# EAGLE design edisonLight (EAGLE 7.0.0)
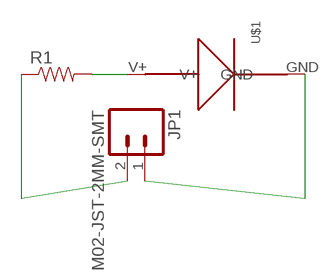
[diagram p0: schematic, sheet 1]

## Parts
JP1  M02-JST-2MM-SMT  [JST-2-SMD]
R1  RESISTOR2010  [R2010]
U$1  MYLEDDEV  [LTW-Z5630LED]

## Nets
N$1: R1.2 U$1.V+
N$2: JP1.1 U$1.GND
N$3: JP1.2 R1.1

## Library data of the parts
JP1 = SparkFun-Connectors:M02: Standard 2-pin 0.1" header. Use with - straight break away headers ( PRT-00116) - right angle break away headers (PRT-00553) - swiss pins (PRT-00743) - machine pins (PRT-00117) - female headers (PRT-00115) Molex polarized connector foot print use with: PRT-08233 with associated crimp pins and housings. 2.54_SCREWTERM for use with PRT-10571. 3.5mm Screw Terminal footprints for PRT-08084 5mm Screw Terminal footprints for use with PRT-08432; PROD_ID: CONN-08352
R1 = SparkFun-Resistors:RESISTOR: Resistor Basic schematic elements and footprints for 0603, 1206, and PTH resistors.
U$1 = Jakelbr:MYLEDDEV

## Board
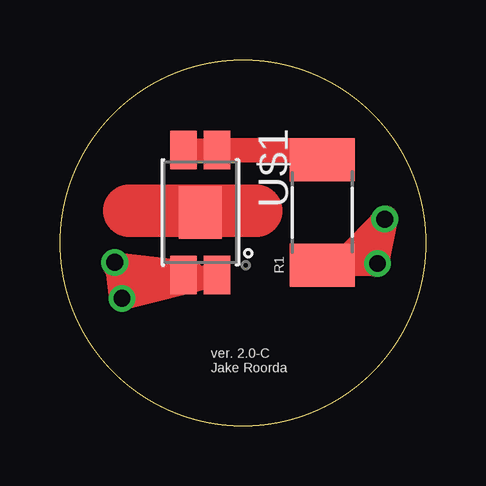
[diagram p1: board, top side]
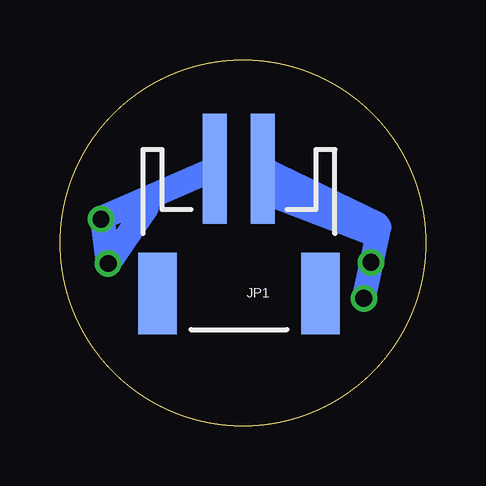
[diagram p2: board, bottom side, seen from below]

Size 15.24 x 15.24 mm. Coordinates in mm from the lower left corner, seen from the top.
Outline: circle at 7.62,7.62 radius 7.62
Copper layers (1*16): Top 0.035mm / dielectric 1.5mm / Bottom 0.035mm
Design rules "default": minimum track width 10mil, minimum drill 24mil, track to track 8mil, track to pad 8mil, pad to pad 8mil, via to via 8mil, smd to smd 8mil, copper to edge 40mil, drill to drill 8mil, minimum pad ring 10mil, minimum via ring 8mil, stop-mask expansion 4mil, vias tented up to drill 0mil, thermal gap 10mil

### Footprints (pad centres in the part's own frame; a part is rotated, then mirrored left to right if it is on the bottom)
JST-2-SMD = smd 1 x 4.6: 1 -1,-3.7; 2 1,-3.7 | smd 1.6 x 3.4: NC1 -3.4,1.5; NC2 3.4,1.5
R2010 = smd 1.8 x 2.7: 1 -2.2,0; 2 2.2,0
LTW-Z5630LED = smd 1.6 x 1.1: GND 2.6,0.7; P$1 -2.6,-0.7; P$3 2.6,-0.7; V+ -2.6,0.7 | smd 2.2 x 1.8: P$6 0,0

### Placement (x,y rotation side)
JP1  7.78,7.01 180 bottom
R1  10.92,8.89 90 top
U$1  5.84,8.89 270 top

### Tracks (layer width: path | path; a pad name or v marks a point on that pad's centre or on a via)
N$1
  Top 1.016: U$1.V+ 10.92,11.49 R1.2
N$2  (via drill 0.7)
  Top 1.016: v2.58,5.31 6.54,6.31 U$1.GND
  Bottom 1.016: v2.58,5.31 1.93,8.27 2.03,8.42 JP1.1
N$3  (via drill 0.7)
  Top 1.016: v13.23,6.76 10.92,6.76 R1.1
  Bottom 1.016: 13.57,8.63 13.48,8.68 | 13.48,8.68 v13.23,6.76 11.63,9.11 | 13.48,8.68 JP1.2
N$5
  Top 1.016: 6.48,11.46 5.18,11.46
N$6
  Top 2.184: 8.18,8.96 2.88,8.96
N$7  (via drill 0.7)
  other vias: 13.53,8.61
N$8
  Top 1.016: 13.18,6.71 13.58,8.66 11.88,6.91
N$9
  Bottom 1.016: 6.58,9.66 2.13,7.96
N$10  (via drill 0.7)
  other vias: 2.28,6.81
N$11
  Top 1.016: 5.23,6.31 2.53,5.51 2.38,6.71 5.48,6.36 2.33,6.61

### Text on the board
tPlace: ver. 2.0-C / Jake Roorda